# EAGLE design automação granja (EAGLE 7.5.0)
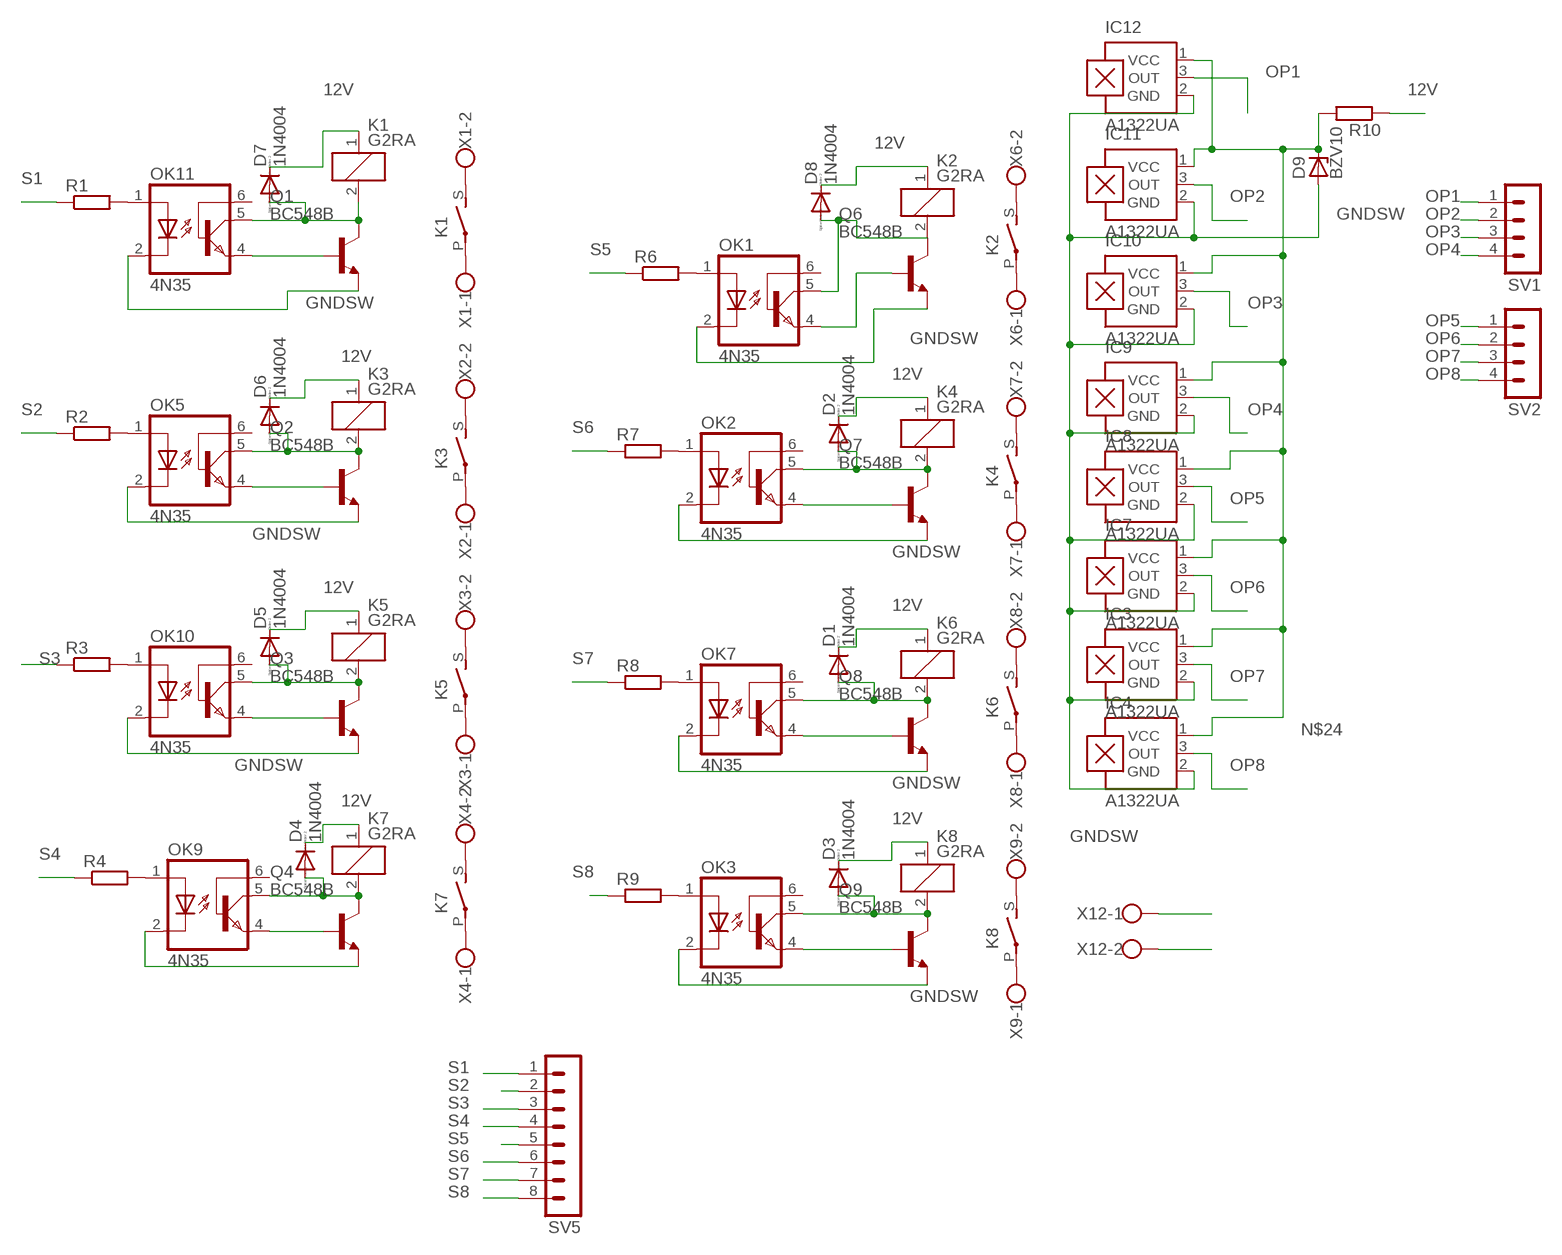
[diagram p0: schematic, sheet 1]

## Parts
D1  1N4004  [DO41-10]
D2  1N4004  [DO41-10]
D3  1N4004  [DO41-10]
D4  1N4004  [DO41-10]
D5  1N4004  [DO41-10]
D6  1N4004  [DO41-10]
D7  1N4004  [DO41-10]
D8  1N4004  [DO41-10]
D9  BZV10  [DO34Z7]
IC3  A1322UA  [SIP3-UA]
IC4  A1322UA  [SIP3-UA]
IC7  A1322UA  [SIP3-UA]
IC8  A1322UA  [SIP3-UA]
IC9  A1322UA  [SIP3-UA]
IC10  A1322UA  [SIP3-UA]
IC11  A1322UA  [SIP3-UA]
IC12  A1322UA  [SIP3-UA]
K1  G2RA  [G2RA]
K2  G2RA  [G2RA]
K3  G2RA  [G2RA]
K4  G2RA  [G2RA]
K5  G2RA  [G2RA]
K6  G2RA  [G2RA]
K7  G2RA  [G2RA]
K8  G2RA  [G2RA]
OK1  4N35  [DIL06]
OK2  4N35  [DIL06]
OK3  4N35  [DIL06]
OK5  4N35  [DIL06]
OK7  4N35  [DIL06]
OK9  4N35  [DIL06]
OK10  4N35  [DIL06]
OK11  4N35  [DIL06]
Q1  BC548B  [TO92-EBC]
Q2  BC548B  [TO92-EBC]
Q3  BC548B  [TO92-EBC]
Q4  BC548B  [TO92-EBC]
Q6  BC548B  [TO92-EBC]
Q7  BC548B  [TO92-EBC]
Q8  BC548B  [TO92-EBC]
Q9  BC548B  [TO92-EBC]
R1  R-EU_0207/7  [0207/7]
R2  R-EU_0207/7  [0207/7]
R3  R-EU_0207/7  [0207/7]
R4  R-EU_0207/7  [0207/7]
R6  R-EU_0207/7  [0207/7]
R7  R-EU_0207/7  [0207/7]
R8  R-EU_0207/7  [0207/7]
R9  R-EU_0207/7  [0207/7]
R10  R-EU_0207/7  [0207/7]
SV1  MA04-1  [MA04-1]
SV2  MA04-1  [MA04-1]
SV5  MA08-1  [MA08-1]
X1  W237-102  [W237-102]
X2  W237-102  [W237-102]
X3  W237-102  [W237-102]
X4  W237-102  [W237-102]
X6  W237-102  [W237-102]
X7  W237-102  [W237-102]
X8  W237-102  [W237-102]
X9  W237-102  [W237-102]
X12  W237-102  [W237-102]

## Nets
12V: D1.C D2.C D3.C D4.C D5.C D6.C D7.C D8.C K1.1 K2.1 K3.1 K4.1 K5.1 K6.1 K7.1 K8.1 R10.1 X12.1
GNDSW: D9.A IC3.2(GND) IC4.2(GND) IC7.2(GND) IC8.2(GND) IC9.2(GND) IC10.2(GND) IC11.2(GND) IC12.2(GND) OK1.2(C) OK2.2(C) OK3.2(C) OK5.2(C) OK7.2(C) OK9.2(C) OK10.2(C) OK11.2(C) Q1.E Q2.E Q3.E Q4.E Q6.E Q7.E Q8.E Q9.E X12.2
N$1: D7.A K1.2 OK11.5(COL) Q1.C
N$2: K1.S(2:S) X1.2
N$3: K1.P(2:P) X1.1
N$4: D6.A K3.2 OK5.5(COL) Q2.C
N$5: K3.S(2:S) X2.2
N$6: K3.P(2:P) X2.1
N$7: K5.S(2:S) X3.2
N$8: K5.P(2:P) X3.1
N$9: D5.A K5.2 OK10.5(COL) Q3.C
N$10: K7.S(2:S) X4.2
N$11: K7.P(2:P) X4.1
N$14: OK1.1(A) R6.2
N$15: OK1.4(EMI) Q6.B
N$16: OK2.4(EMI) Q7.B
N$17: D4.A K7.2 OK9.5(COL) Q4.C
N$19: OK7.4(EMI) Q8.B
N$20: OK3.4(EMI) Q9.B
N$21: D8.A K2.2 OK1.5(COL) Q6.C
N$22: K2.S(2:S) X6.2
N$23: K2.P(2:P) X6.1
N$24: D9.C IC3.1(VCC) IC4.1(VCC) IC7.1(VCC) IC8.1(VCC) IC9.1(VCC) IC10.1(VCC) IC11.1(VCC) IC12.1(VCC) R10.2
N$25: D2.A K4.2 OK2.5(COL) Q7.C
N$26: K4.S(2:S) X7.2
N$27: K4.P(2:P) X7.1
N$28: K6.S(2:S) X8.2
N$29: K6.P(2:P) X8.1
N$30: D1.A K6.2 OK7.5(COL) Q8.C
N$31: OK2.1(A) R7.2
N$32: OK7.1(A) R8.2
N$33: K8.S(2:S) X9.2
N$34: K8.P(2:P) X9.1
N$37: D3.A K8.2 OK3.5(COL) Q9.C
N$39: OK3.1(A) R9.2
N$68: OK11.1(A) R1.2
N$69: OK5.1(A) R2.2
N$70: OK10.1(A) R3.2
N$71: OK9.1(A) R4.2
N$73: OK5.4(EMI) Q2.B
N$74: OK10.4(EMI) Q3.B
N$75: OK9.4(EMI) Q4.B
N$79: OK11.4(EMI) Q1.B
OP1: IC12.3(OUT) SV1.1
OP2: IC11.3(OUT) SV1.2
OP3: IC10.3(OUT) SV1.3
OP4: IC9.3(OUT) SV1.4
OP5: IC8.3(OUT) SV2.1
OP6: IC7.3(OUT) SV2.2
OP7: IC3.3(OUT) SV2.3
OP8: IC4.3(OUT) SV2.4
S1: R1.1 SV5.1
S2: R2.1 SV5.2
S3: R3.1 SV5.3
S4: R4.1 SV5.4
S5: R6.1 SV5.5
S6: R7.1 SV5.6
S7: R8.1 SV5.7
S8: R9.1 SV5.8
Unconnected: OK1.6(BAS) OK2.6(BAS) OK3.6(BAS) OK5.6(BAS) OK7.6(BAS) OK9.6(BAS) OK10.6(BAS) OK11.6(BAS)

## Library data of the parts
D1-D8 = diode:1N4004: DIODE general purpose rectifier, 1 A
D9 = diode:BZV10: Z DIODE
IC3 IC4 IC7-IC12 = allegro:A13*?: Linear Hall Effect Sensor ICs Continuous-Time Ratiometric High-Temperature Operation Programmable Linear with Analog Output A1302 -Replacement- UGN3503 Source: http://www.allegromicro.com/en/Products/Part_Numbers/1301/1301.pdf http://www.allegromicro.com/en/Products/Part_Numbers/1321/1321.pdf http://www.allegromicro.com/en/Products/Part_Numbers/1381/1381.pdf; MF: ALLEGRO MICROSYSTEMS, INC.; MPN: A1322LUA-T; OC_FARNELL: unknown; OC_NEWARK: 65K5150
K1-K8 = relay:G2RA: RELAY 1 x norm. open, Omron; OC_FARNELL: unknown; OC_NEWARK: unknown
OK1-OK3 OK5 OK7 OK9-OK11 = optocoupler:4N35: MOTOROLA OPTO COUPLER; MF: FAIRCHILD SEMICONDUCTOR; MPN: 4N35; OC_FARNELL: 1328375; OC_NEWARK: 72K9946
Q1-Q4 Q6-Q9 = transistor-npn:BC548*: NPN Transistor
R1-R4 R6-R10 = rcl:R-EU_: RESISTOR, European symbol
SV1 SV2 = con-lstb:MA04-1: PIN HEADER; OC_FARNELL: unknown; OC_NEWARK: unknown
SV5 = con-lstb:MA08-1: PIN HEADER; OC_FARNELL: unknown; OC_NEWARK: unknown
X1-X4 X6-X9 X12 = con-wago-500:W237-102: WAGO SCREW CLAMP; MPN: 237-102; OC_FARNELL: unknown; OC_NEWARK: 70K9898

## Board
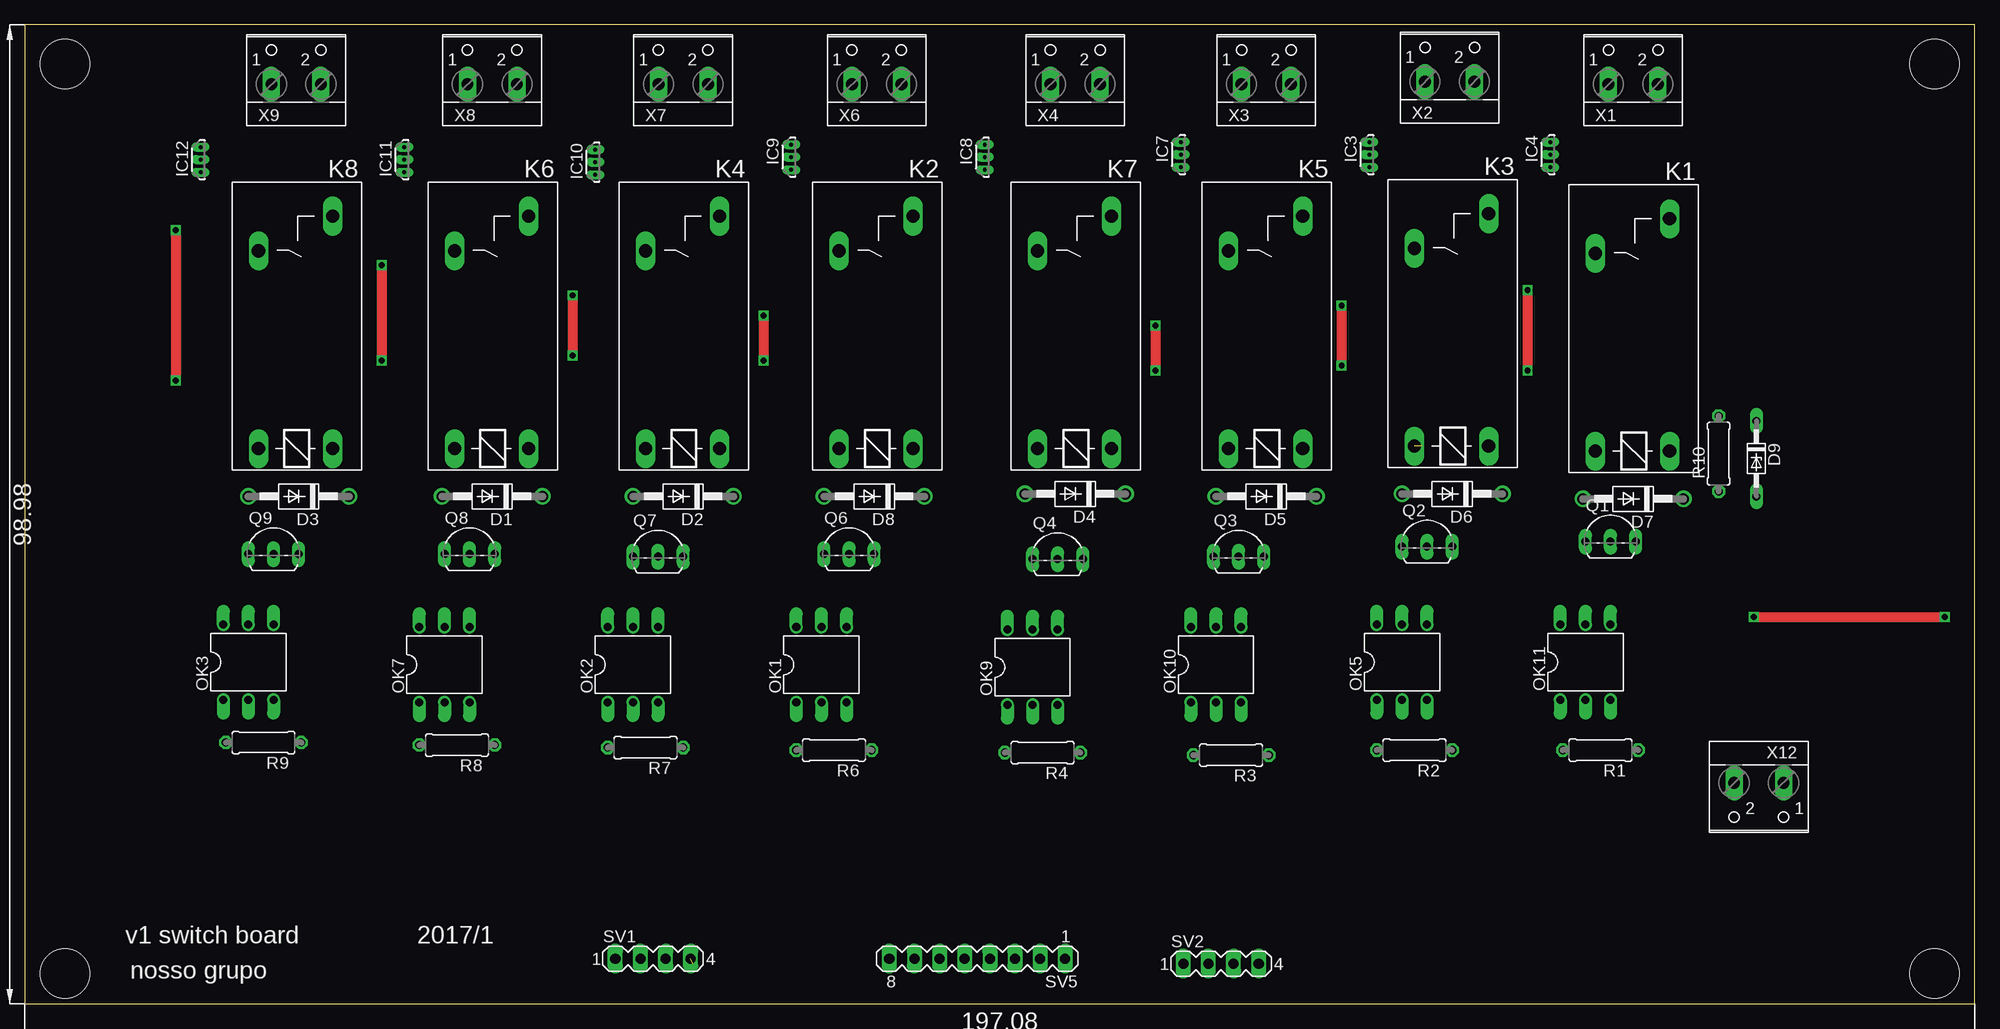
[diagram p1: board, top side]
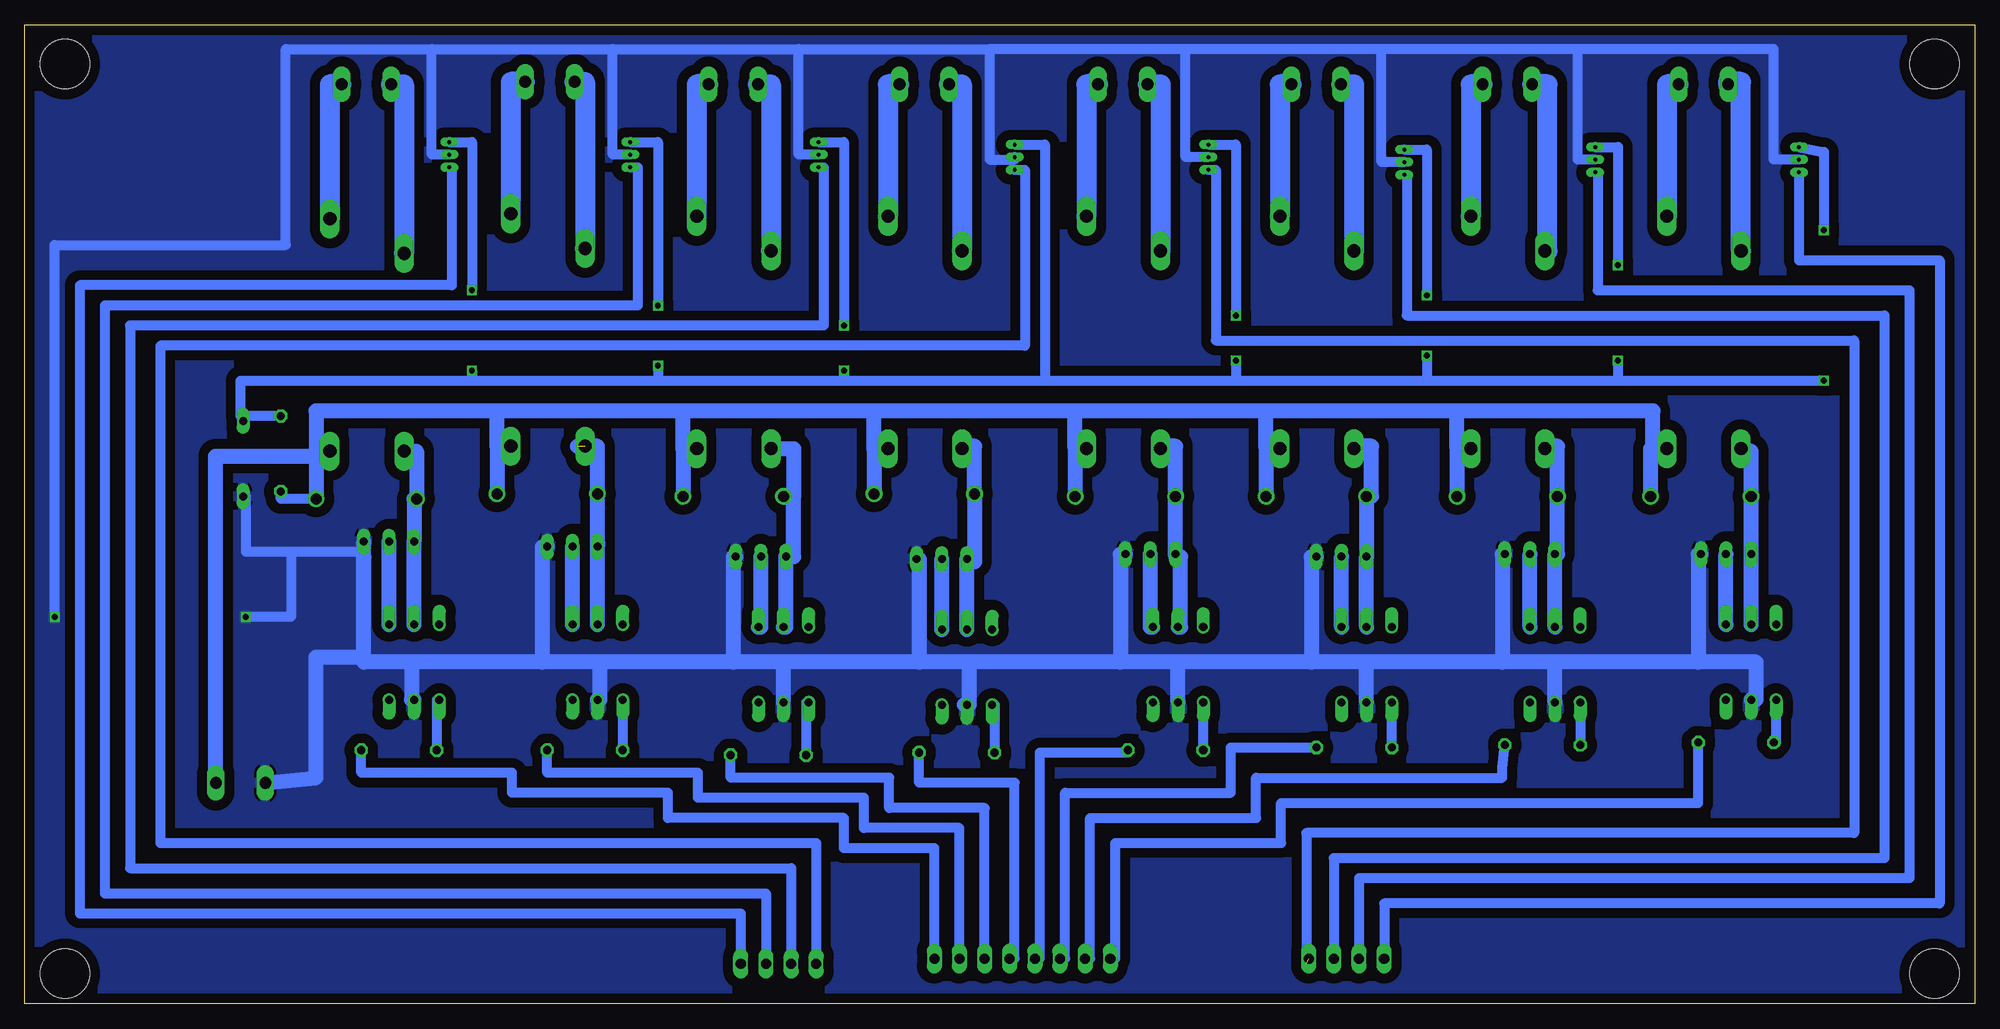
[diagram p2: board, bottom side, seen from below]

Size 197.08 x 98.98 mm. Coordinates in mm from the lower left corner, seen from the top.
Outline: 0,0 197.08,0 197.08,98.98 0,98.98 0,0
Copper layers (1*16): Top 0.035mm / dielectric 1.5mm / Bottom 0.035mm
Design rules "default": minimum track width 10mil, minimum drill 24mil, track to track 8mil, track to pad 8mil, pad to pad 8mil, via to via 8mil, smd to smd 8mil, copper to edge 40mil, drill to drill 8mil, minimum pad ring 10mil, minimum via ring 8mil, stop-mask expansion 4mil, vias tented up to drill 0mil, thermal gap 10mil
Holes 5 mm at 4.06,95 193.04,95 193.04,3.05 4.06,3.05

### Footprints (pad centres in the part's own frame; a part is rotated, then mirrored left to right if it is on the bottom)
DO41-10 = drill 1.118: A 5.08,0; C -5.08,0
DO34Z7 = drill 0.813 long: A 3.81,0; C -3.81,0
SIP3-UA = drill 0.4 pad 0.5 long: 1 -1.27,0; 2 0,0; 3 1.27,0
G2RA = drill 1.321 long: 1 -3.81,-3.683; 2 -3.81,3.81; P 16.18,3.81; S 19.685,-3.683
DIL06 = drill 0.813 offset: 1 -2.54,-3.81; 2 0,-3.81; 3 2.54,-3.81; 4 2.54,3.81; 5 0,3.81; 6 -2.54,3.81
TO92-EBC = drill 0.813 long: B 0,-1.27; C -2.54,-1.27; E 2.54,-1.27
0207/7 = drill 0.813 octagon: 1 -3.81,0; 2 3.81,0
MA04-1 = drill 1.016 long: 1 -3.81,0; 2 -1.27,0; 3 1.27,0; 4 3.81,0
MA08-1 = drill 1.016 long: 1 -8.89,0; 2 -6.35,0; 3 -3.81,0; 4 -1.27,0; 5 1.27,0; 6 3.81,0; 7 6.35,0; 8 8.89,0
W237-102 = drill 1.194 long: 1 -2.5,-1.27; 2 2.5,-1.27

### Placement (x,y rotation side)
D1  47.24,51.31 180 top
D2  66.55,51.31 180 top
D3  27.69,51.31 180 top
D4  106.17,51.56 180 top
D5  125.48,51.31 180 top
D6  144.27,51.56 180 top
D7  162.56,51.05 180 top
D8  85.85,51.31 180 top
D9  175.01,55.12 270 top
IC3  135.89,85.85 270 top
IC4  154.18,85.85 270 top
IC7  116.84,85.85 270 top
IC8  97.03,85.6 270 top
IC9  77.47,85.6 270 top
IC10  57.66,85.09 270 top
IC11  38.35,85.34 270 top
IC12  17.78,85.34 270 top
K1  162.56,59.69 90 top
K2  86.11,59.94 90 top
K3  144.27,60.2 90 top
K4  66.55,59.94 90 top
K5  125.48,59.94 90 top
K6  47.24,59.94 90 top
K7  106.17,59.94 90 top
K8  27.43,59.94 90 top
OK1  80.52,34.29 0 top
OK2  61.47,34.29 0 top
OK3  22.61,34.54 0 top
OK5  139.19,34.54 0 top
OK7  42.42,34.29 0 top
OK9  101.85,34.04 0 top
OK10  120.4,34.29 0 top
OK11  157.73,34.54 0 top
Q1  160.27,48.01 0 top
Q2  141.73,47.5 0 top
Q3  122.68,46.48 0 top
Q4  104.39,46.23 0 top
Q6  83.31,46.74 0 top
Q7  64.01,46.48 0 top
Q8  44.96,46.74 0 top
Q9  25.15,46.74 0 top
R1  159.26,25.65 180 top
R2  140.46,25.65 180 top
R3  121.92,25.15 180 top
R4  102.87,25.4 180 top
R6  81.79,25.65 180 top
R7  62.74,25.91 180 top
R8  43.69,26.16 180 top
R9  24.13,26.42 180 top
R10  171.2,55.63 90 top
SV1  63.5,4.57 0 top
SV2  120.9,4.06 0 top
SV5  96.27,4.57 180 top
X1  162.56,94.23 0 top
X2  144.02,94.49 0 top
X3  125.48,94.23 0 top
X4  106.17,94.23 0 top
X6  86.11,94.23 0 top
X7  66.55,94.23 0 top
X8  47.24,94.23 0 top
X9  27.43,94.23 0 top
X12  175.26,21.08 180 top

### Tracks (layer width: path | path; a pad name or v marks a point on that pad's centre or on a via)
12V
  Bottom 1: D7.C 171.2,51.05 R10.1
  Bottom 1.5: K8.1 32.51,56.13 | D3.C 32.77,56.13 32.51,56.13 | K6.1 52.32,56.13 | 52.32,56.13 D1.C | K4.1 71.63,56.13 | 71.63,56.13 D2.C | 90.93,56.13 D8.C | K7.1 111.25,56.13 | 111.25,56.13 D4.C | K5.1 130.56,56.13 | 130.56,56.13 D5.C | K3.1 149.35,56.39 | 149.35,56.39 D6.C | K1.1 167.64,55.88 | 167.64,55.88 167.64,55.37 | 167.64,55.37 D7.C | 32.51,56.13 32.51,59.94 52.32,59.94 | 52.32,59.94 71.63,59.94 | 71.63,59.94 90.93,59.94 | 90.93,59.94 111.25,59.94 | 111.25,59.94 130.56,59.94 | 130.56,59.94 149.35,59.94 | 149.35,59.94 167.64,59.94 167.64,55.88 | 52.32,56.13 52.32,59.94 | 71.63,56.13 71.63,59.94 | K2.1 90.93,56.13 | 90.93,56.13 90.93,59.94 | 149.35,56.39 149.35,59.94 | 130.56,56.13 130.56,59.94 | 111.25,56.13 111.25,59.94 | X12.1 177.8,22.35 177.8,55.37 167.64,55.37
GNDSW  (via drill 0.6)
  Top 1: v174.75,39.12 v194.06,39.12
  Bottom 1: D9.A 174.75,51.31 174.75,45.72 170.18,45.72 | 170.18,45.72 162.81,45.72 162.81,45.21 | IC12.2 20.32,85.34 20.32,96.52 40.13,96.52 | 40.13,96.52 59.94,96.52 | 59.94,96.52 79.76,96.52 | 79.76,96.52 99.57,96.52 | 99.57,96.52 99.57,85.34 97.03,85.34 IC8.2 | IC9.2 79.76,85.6 79.76,96.52 | IC10.2 59.94,85.09 59.94,96.52 | IC11.2 40.13,85.34 40.13,96.52 | IC4.2 155.96,85.85 155.96,96.52 | 155.96,96.52 137.67,96.52 | 137.67,96.52 118.87,96.52 | 118.87,96.52 99.57,96.52 | IC7.2 118.87,85.85 118.87,96.52 | IC3.2 137.67,85.85 137.67,96.52 | 170.18,45.72 170.18,39.12 v174.75,39.12 | v194.06,39.12 194.06,76.71 170.69,76.71 170.69,96.52 155.96,96.52
  Bottom 1.5: OK3.2 22.1,30.73 22.1,34.54 27.94,34.54 | 27.94,34.54 42.42,34.54 | 42.42,34.54 47.75,34.54 | 47.75,34.54 61.47,34.54 | 61.47,34.54 67.06,34.54 | 67.06,34.54 80.52,34.54 | 80.52,34.54 86.36,34.54 | 86.36,34.54 101.6,34.54 | 101.6,34.54 106.68,34.54 | 106.68,34.54 120.4,34.54 | 120.4,34.54 125.48,34.54 | 125.48,34.54 138.94,34.54 | 138.94,34.54 144.78,34.54 | 144.78,34.54 157.99,34.54 | 157.99,34.54 157.99,30.73 OK11.2 | OK7.2 42.42,34.54 | OK2.2 61.47,34.54 | OK1.2 80.52,34.54 | 102.11,30.23 OK9.2 101.6,30.23 101.6,34.54 | OK5.2 138.94,30.73 138.94,34.54 | OK10.2 120.4,34.54 | Q9.E 27.94,45.47 27.94,34.54 | Q8.E 47.75,45.47 47.75,34.54 | Q7.E 67.06,45.21 67.06,34.54 | Q6.E 86.36,45.47 86.36,34.54 | Q4.E 106.68,44.96 106.68,34.54 | Q3.E 125.48,45.21 125.48,34.54 | Q2.E 144.78,46.23 144.78,34.54 | 157.99,34.54 162.81,34.54 162.81,35.05 | 162.81,35.05 162.81,45.21 Q1.E | X12.2 167.64,22.86 167.64,35.05 162.81,35.05
  pour Bottom (isolate 1): 3.05,99.06 197.1,98.55 197.1,-1.52 0,-1.52 0,99.06
N$1
  Bottom 1.5: OK11.5 Q1.C 157.73,51.05 D7.A 157.48,55.88 K1.2
N$2
  Bottom 2: X1.2 166.24,92.96 K1.S
N$3
  Bottom 2: X1.1 158.75,92.96 K1.P
N$4  (1 unrouted)
  Bottom 1.5: OK5.5 Q2.C | 139.19,46.74 Q2.C | Q2.C D6.A 139.19,56.39 141.22,56.39
N$5
  Bottom 2: X2.2 147.96,93.22 K3.S
N$6
  Bottom 2: X2.1 140.46,93.22 K3.P
N$7
  Bottom 2: X3.2 129.16,92.96 K5.S
N$8
  Bottom 2: X3.1 121.67,92.96 K5.P
N$9
  Bottom 1.5: OK10.5 120.14,38.1 Q3.C 119.38,45.21 119.38,51.31 | 119.38,51.31 D5.A | K5.2 119.38,56.13 119.38,51.31
N$10
  Bottom 2: X4.2 109.86,92.96 K7.S
N$11
  Bottom 2: X4.1 102.36,92.96 K7.P
N$14
  Bottom 1: R6.2 OK1.1
N$15
  Bottom 1.5: OK1.4 83.31,38.1 Q6.B
N$16
  Bottom 1.5: OK2.4 Q7.B
N$17
  Bottom 1.5: OK9.5 Q4.C 101.85,44.7 101.09,44.7 D4.A 101.09,56.39 102.36,56.39 K7.2
N$19
  Bottom 1.5: OK7.4 Q8.B
N$20
  Bottom 1.5: OK3.4 Q9.B
N$21
  Bottom 1.5: OK1.5 80.26,38.1 80.26,45.21 80.77,45.21 Q6.C D8.A 80.77,56.39 82.3,56.39 K2.2
N$22
  Bottom 2: X6.2 89.79,92.96 K2.S
N$23
  Bottom 2: X6.1 82.3,92.96 K2.P
N$24  (via drill 0.6)
  Top 1: v15.24,78.23 v15.24,62.99 | v36.07,74.68 v36.07,65.02 | v55.37,71.63 v55.37,65.53 | v74.68,69.6 v74.68,65.02 | v114.3,68.58 v114.3,64.01 | v133.1,70.61 v133.1,64.52 | v151.89,72.14 v151.89,64.01
  Bottom 1: D9.C 175.01,59.44 R10.2 175.26,59.44 175.26,62.99 151.89,62.99 | 151.89,62.99 133.1,62.99 | 133.1,62.99 114.3,62.99 | 114.3,62.99 93.98,62.99 | 93.98,62.99 74.68,62.99 | 74.68,62.99 55.37,62.99 | 55.37,62.99 36.07,62.99 | 36.07,62.99 v15.24,62.99 | IC12.1 15.24,86.11 v15.24,78.23 | IC11.1 36.07,86.61 v36.07,74.68 | v36.07,65.02 36.07,62.99 | IC10.1 55.37,86.36 v55.37,71.63 | v55.37,65.53 55.37,62.99 | IC9.1 74.68,86.87 v74.68,69.6 | v74.68,65.02 74.68,62.99 | IC8.1 93.98,86.87 93.98,62.99 | IC7.1 114.3,87.12 v114.3,68.58 | v114.3,64.01 114.3,62.99 | IC3.1 133.1,87.12 v133.1,70.61 | v133.1,64.52 133.1,62.99 | IC4.1 151.89,87.12 v151.89,72.14 | v151.89,64.01 151.89,62.99
N$25
  Bottom 1.5: OK2.5 Q7.C D2.A 60.96,51.31 60.96,56.39 62.74,56.39 K4.2
N$26
  Bottom 2: X7.2 70.23,92.96 K4.S
N$27
  Bottom 2: X7.1 62.74,92.96 K4.P
N$28
  Bottom 2: X8.2 50.93,92.96 K6.S
N$29
  Bottom 2: K6.P 43.18,76.12 43.18,92.96 X8.1
N$30
  Bottom 1.5: OK7.5 Q8.C 42.16,45.47 D1.A 42.16,56.39 43.43,56.39 K6.2
N$31
  Bottom 1: R7.2 OK2.1
N$32
  Bottom 1: OK7.1 R8.2
N$33
  Bottom 2: X9.2 31.11,92.96 K8.S
N$34
  Bottom 2: K8.P 23.62,93.22 24.93,93.22 X9.1
N$37
  Bottom 1.5: K8.2 23.62,55.88 22.61,55.88 D3.A Q9.C OK3.5
N$39
  Bottom 1: R9.2 20.07,26.42 OK3.1
N$68
  Bottom 1: OK11.1 155.45,30.73 R1.2
N$69
  Bottom 1: OK5.1 R2.2
N$70
  Bottom 1: OK10.1 118.11,30.48 R3.2
N$71
  Bottom 1: OK9.1 99.06,30.23 R4.2
N$73
  Bottom 1.5: OK5.4 Q2.B
N$74
  Bottom 1.5: OK10.4 122.68,38.1 Q3.B
N$75
  Bottom 1.5: OK9.4 Q4.B
N$79
  Bottom 1.5: OK11.4 Q1.B
OP1
  Bottom 1: IC12.3 17.78,75.18 3.56,75.18 3.56,10.16 59.69,10.16 SV1.1
OP2
  Bottom 1: IC11.3 38.1,84.07 38.1,72.14 6.6,72.14 6.6,12.7 62.23,12.7 SV1.2
OP3
  Bottom 1: IC10.3 57.4,83.82 57.4,69.6 9.14,69.6 9.14,14.73 64.77,14.73 SV1.3
OP4  (1 unrouted)
  Bottom 1: IC9.3 76.71,84.33 76.71,67.06 12.19,67.06 12.19,17.27 67.56,17.27 67.56,4.06
OP5
  Bottom 1: IC8.3 96.01,84.33 96.01,66.55 183.39,66.55 183.39,16.26 117.09,16.26 SV2.1
OP6
  Bottom 1: IC7.3 116.33,84.58 116.33,68.58 186.44,68.58 186.44,13.72 119.63,13.72 SV2.2
OP7
  Bottom 1: IC3.3 135.13,84.58 135.13,70.61 188.98,70.61 188.98,11.18 122.17,11.18 SV2.3
OP8
  Bottom 1: IC4.3 153.92,84.58 153.92,72.64 191.52,72.64 191.52,9.14 124.71,9.14 SV2.4
S1
  Bottom 1: SV5.1 105.16,15.75 114.3,15.75 114.3,18.8 132.08,18.8 132.08,21.34 147.83,21.34 147.83,23.37 163.07,23.37 R1.1
S2
  Bottom 1: SV5.2 102.62,17.78 112.27,17.78 112.27,20.83 129.03,20.83 129.03,23.37 144.27,23.37 R2.1
S3
  Bottom 1: SV5.3 100.08,19.81 109.73,19.81 109.73,22.86 125.73,22.86 R3.1
S4
  Bottom 1: SV5.4 97.03,4.57 97.03,22.35 106.68,22.35 R4.1
S5
  Bottom 1: SV5.5 94.49,4.57 94.49,25.4 85.6,25.4 R6.1
S6
  Bottom 1: SV5.6 91.95,4.57 91.95,21.34 75.18,21.34 75.18,25.91 R7.1
S7
  Bottom 1: SV5.7 89.41,4.57 89.41,18.8 72.64,18.8 72.64,22.86 47.75,22.86 47.75,23.88 R8.1
S8
  Bottom 1: SV5.8 86.87,4.57 86.87,16.26 70.1,16.26 70.1,20.32 27.94,20.32 R9.1

### Text on the board
tNames: v1 switch board | 2017/1 | nosso grupo